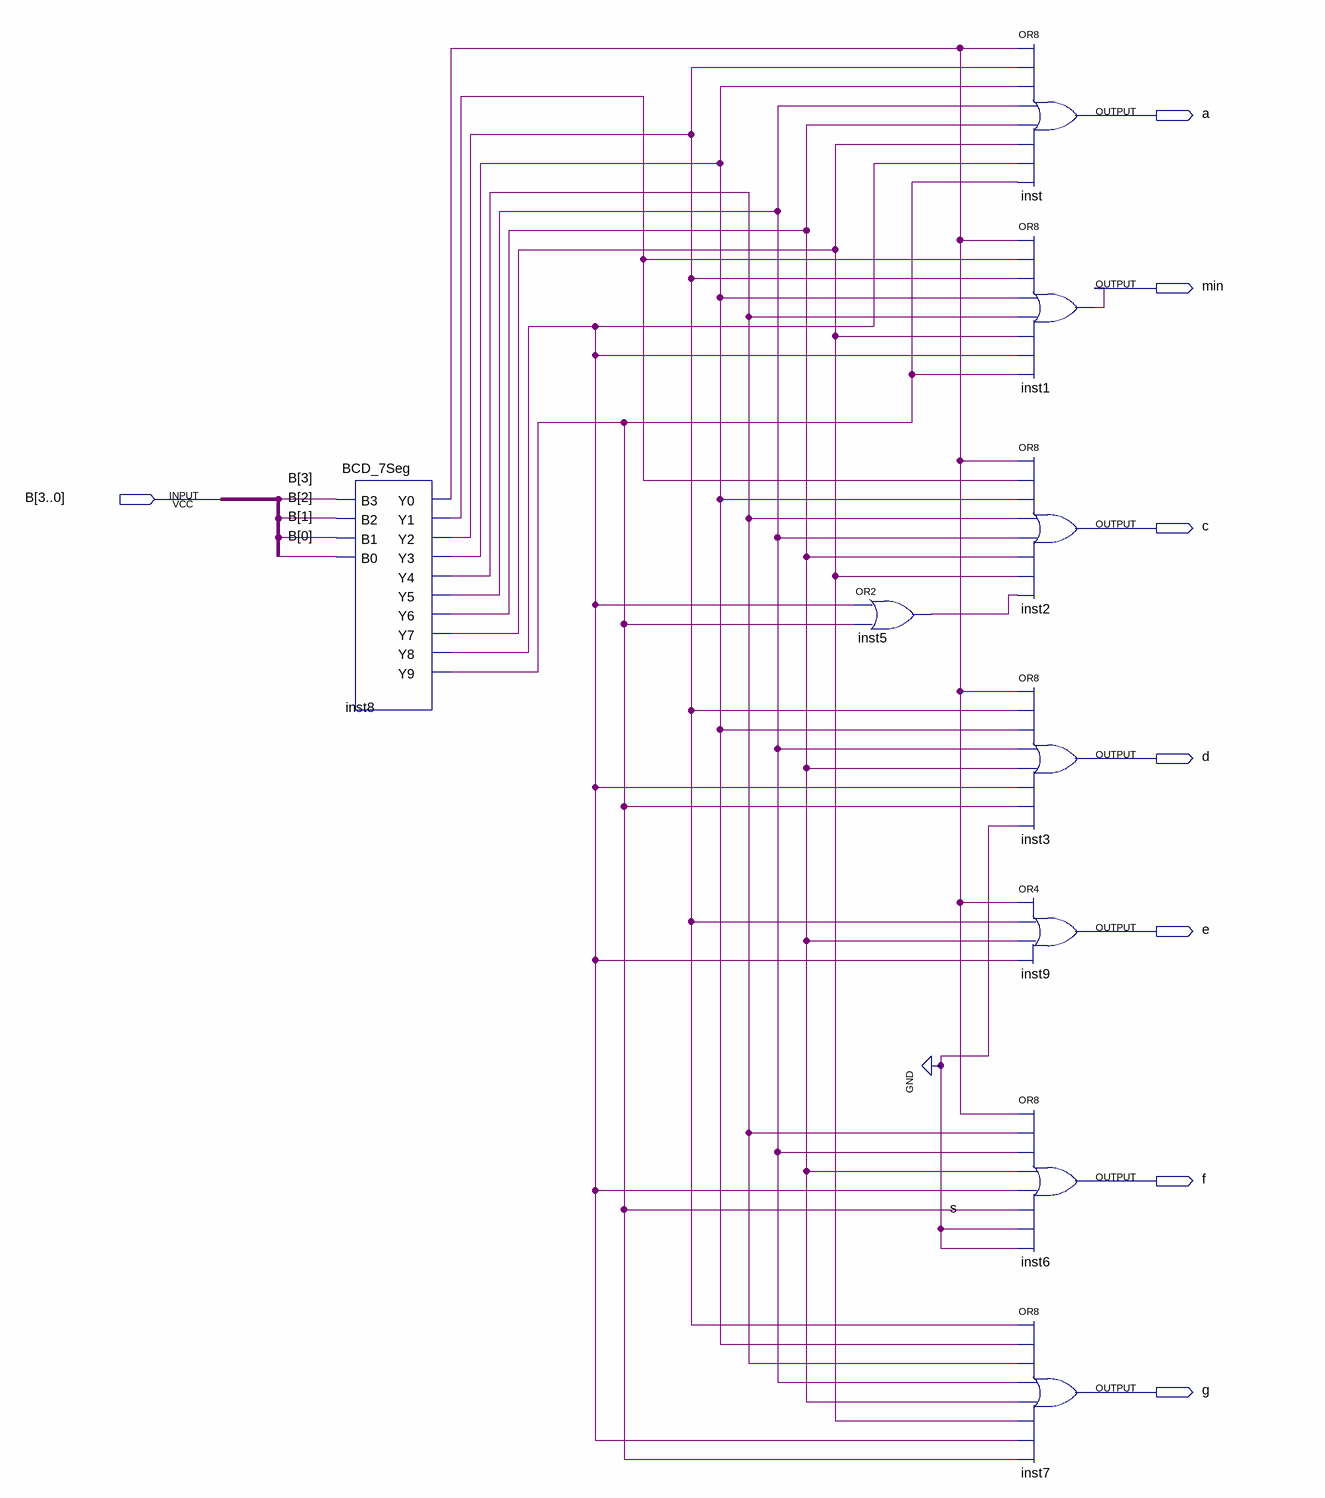
[diagram p0: schematic sheet]
// Quartus schematic BCD_7SegProj.bdf as structural Verilog: 9 symbols, 8 pins
module BCD_7SegProj (
  input  [3:0] B,
  output a,
  output min,
  output c,
  output d,
  output e,
  output f,
  output g
);

  wire inst5_out, inst8_y0, inst8_y1, inst8_y2, inst8_y3, inst8_y4, inst8_y5, inst8_y6, inst8_y7, inst8_y8,
       inst8_y9;

  BCD_7Seg inst8 (
    .B3(B[3]), .B2(B[2]), .B1(B[1]), .B0(B[0]), .Y0(inst8_y0), .Y1(inst8_y1), .Y2(inst8_y2), .Y3(inst8_y3),
    .Y4(inst8_y4), .Y5(inst8_y5), .Y6(inst8_y6), .Y7(inst8_y7), .Y8(inst8_y8), .Y9(inst8_y9));
  or inst5 (inst5_out, inst8_y8, inst8_y9);
  or inst (a, inst8_y0, inst8_y2, inst8_y3, inst8_y5, inst8_y6, inst8_y7, inst8_y8, inst8_y9);
  or inst1 (min, inst8_y0, inst8_y1, inst8_y2, inst8_y3, inst8_y4, inst8_y7, inst8_y8, inst8_y9);
  or inst2 (c, inst8_y0, inst8_y1, inst8_y3, inst8_y4, inst8_y5, inst8_y6, inst8_y7, inst5_out);
  or inst3 (d, inst8_y0, inst8_y2, inst8_y3, inst8_y5, inst8_y6, inst8_y8, inst8_y9, 1'b0);
  or inst9 (e, inst8_y0, inst8_y2, inst8_y6, inst8_y8);
  or inst6 (f, inst8_y0, inst8_y4, inst8_y5, inst8_y6, inst8_y8, inst8_y9, 1'b0, 1'b0);
  or inst7 (g, inst8_y2, inst8_y3, inst8_y4, inst8_y5, inst8_y6, inst8_y7, inst8_y8, inst8_y9);
endmodule
